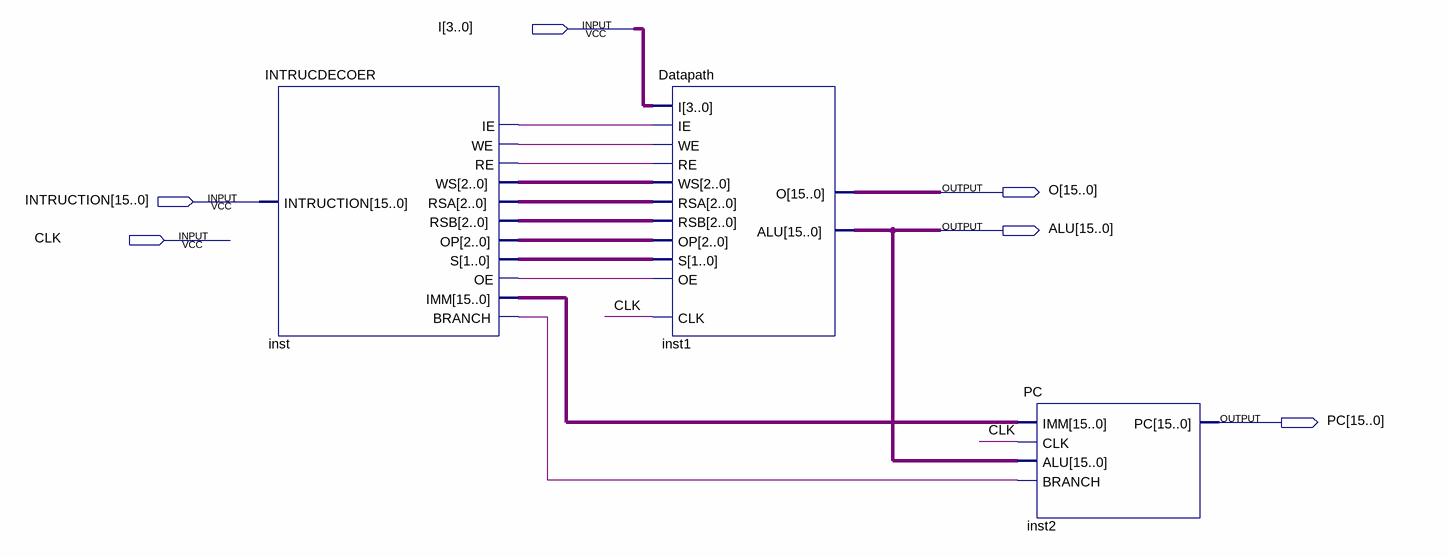
[diagram p0: schematic sheet]
// Quartus schematic morong.bdf as structural Verilog: 3 symbols, 6 pins
module morong (
  input  [3:0] I,
  input  [15:0] INTRUCTION,
  input  CLK,
  output [15:0] O,
  output [15:0] ALU,
  output [15:0] PC
);

  wire inst_branch, inst_ie, inst_oe, inst_re, inst_we;
  wire [1:0] inst_s;
  wire [2:0] inst_op, inst_rsa, inst_rsb, inst_ws;
  wire [15:0] inst_imm;

  INTRUCDECOER inst (
    .INTRUCTION(INTRUCTION), .IE(inst_ie), .WE(inst_we), .WS(inst_ws), .RSA(inst_rsa), .RSB(inst_rsb),
    .OP(inst_op), .S(inst_s), .OE(inst_oe), .BRANCH(inst_branch), .IMM(inst_imm), .RE(inst_re));
  Datapath inst1 (
    .I(I), .IE(inst_ie), .RSA(inst_rsa), .WS(inst_ws), .WE(inst_we), .RSB(inst_rsb), .OE(inst_oe),
    .S(inst_s), .OP(inst_op), .CLK(CLK), .RE(inst_re), .ALU(ALU), .O(O));
  PC inst2 (.IMM(inst_imm), .CLK(CLK), .ALU(ALU), .BRANCH(inst_branch), .PC(PC));
endmodule
